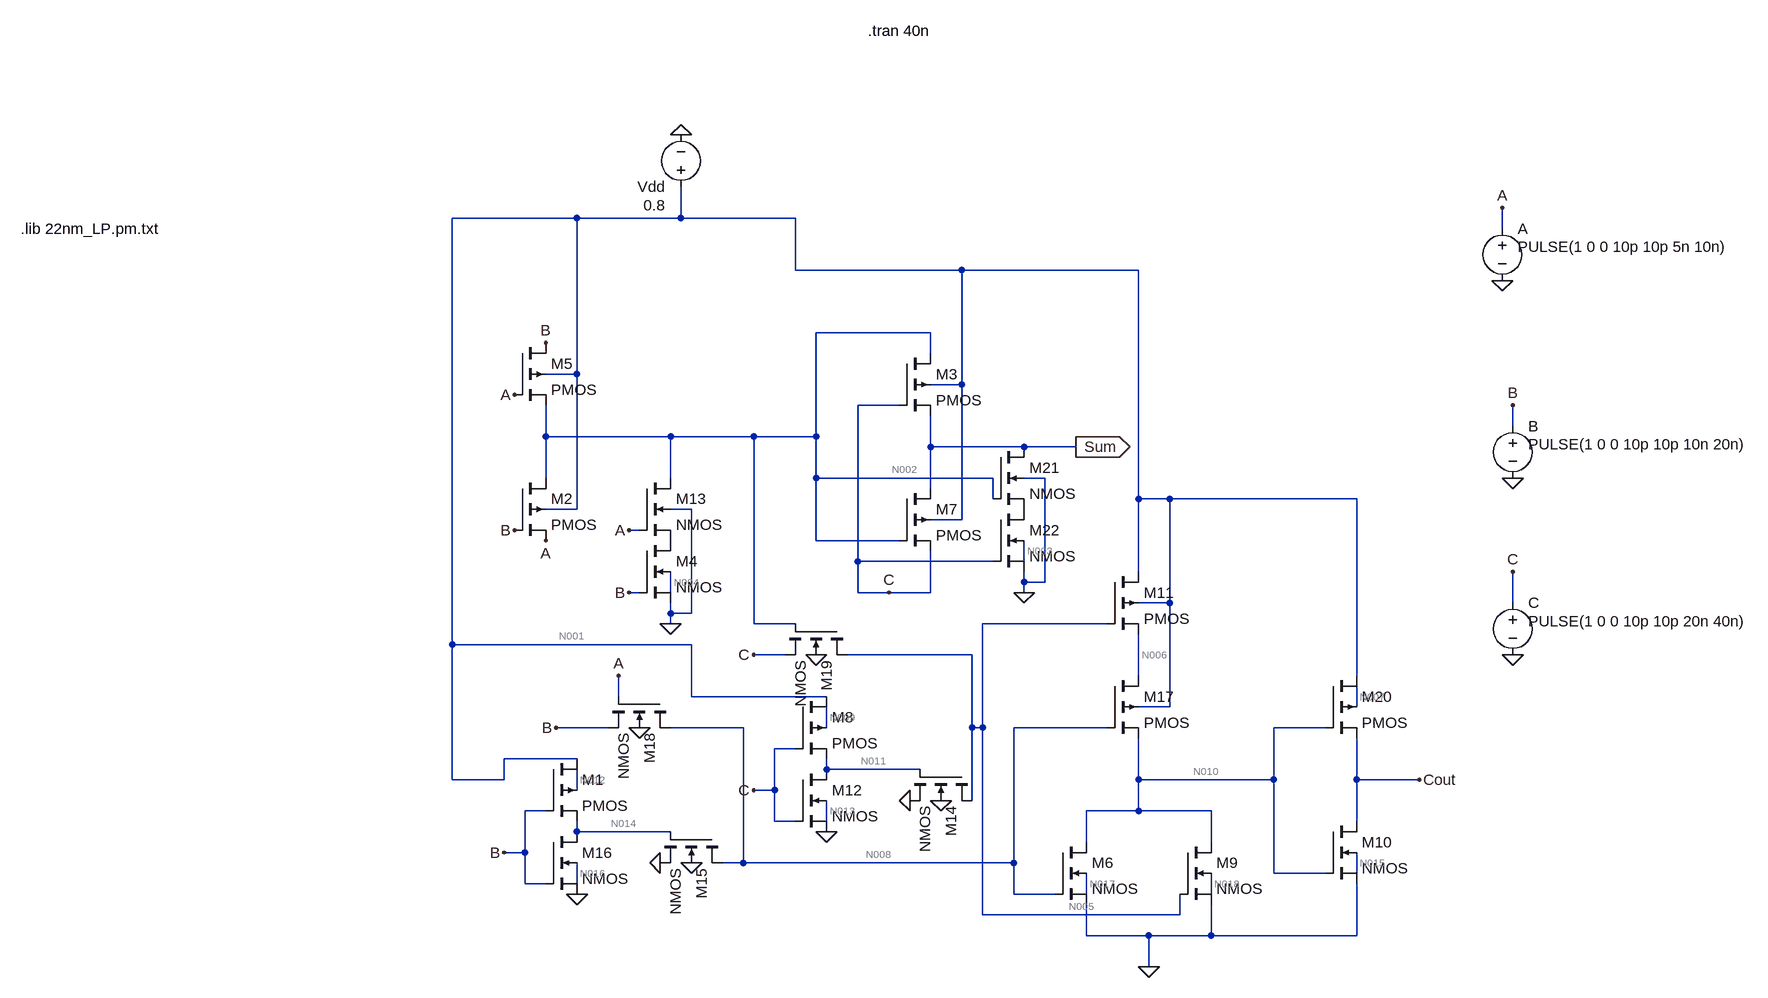
[diagram p0: schematic XA12T_45nm.asc]
XA12T_45nm.asc, the LTspice schematic file:
Version 4
SHEET 1 1060 3520
WIRE -800 -240 -992 -240
WIRE -640 -240 -640 -288
WIRE -640 -240 -800 -240
WIRE -464 -240 -640 -240
WIRE 624 -224 624 -256
WIRE -464 -160 -464 -240
WIRE -208 -160 -464 -160
WIRE 64 -160 -208 -160
WIRE -256 -64 -432 -64
WIRE -256 -32 -256 -64
WIRE -800 0 -800 -240
WIRE -800 0 -848 0
WIRE -208 16 -208 -160
WIRE -208 16 -256 16
WIRE -304 48 -368 48
WIRE 640 80 640 48
WIRE -848 96 -848 48
WIRE -656 96 -848 96
WIRE -528 96 -656 96
WIRE -432 96 -432 -64
WIRE -432 96 -528 96
WIRE -256 112 -256 64
WIRE -112 112 -256 112
WIRE -32 112 -112 112
WIRE -848 160 -848 96
WIRE -656 160 -656 96
WIRE -432 160 -432 96
WIRE -160 160 -432 160
WIRE -80 160 -112 160
WIRE -256 176 -256 112
WIRE -160 192 -160 160
WIRE 64 192 64 -160
WIRE 112 192 64 192
WIRE 400 192 112 192
WIRE -800 208 -800 0
WIRE -800 208 -848 208
WIRE -624 208 -656 208
WIRE -208 224 -208 16
WIRE -208 224 -256 224
WIRE -704 240 -720 240
WIRE -432 256 -432 160
WIRE -304 256 -432 256
WIRE -368 288 -368 48
WIRE -160 288 -368 288
WIRE -112 288 -112 256
WIRE 64 304 64 192
WIRE -112 320 -112 304
WIRE -80 320 -80 160
WIRE -80 320 -112 320
WIRE -704 336 -720 336
WIRE -656 336 -656 304
WIRE -368 336 -368 288
WIRE -320 336 -368 336
WIRE -256 336 -256 272
WIRE -256 336 -320 336
WIRE -112 336 -112 320
WIRE 112 352 112 192
WIRE 112 352 64 352
WIRE 640 352 640 304
WIRE -656 368 -656 352
WIRE -624 368 -624 208
WIRE -624 368 -656 368
WIRE -656 384 -656 368
WIRE -528 384 -528 96
WIRE -464 384 -528 384
WIRE 16 384 -176 384
WIRE -992 416 -992 -240
WIRE -624 416 -992 416
WIRE -480 432 -528 432
WIRE -192 432 -384 432
WIRE 64 464 64 400
WIRE 400 464 400 192
WIRE -736 496 -736 464
WIRE -624 496 -624 416
WIRE -416 496 -624 496
WIRE 112 512 112 352
WIRE 112 512 64 512
WIRE 400 512 400 480
WIRE -752 544 -832 544
WIRE -544 544 -656 544
WIRE -416 544 -416 512
WIRE -192 544 -192 432
WIRE -176 544 -176 384
WIRE -176 544 -192 544
WIRE 16 544 -128 544
WIRE 352 544 272 544
WIRE -464 576 -496 576
WIRE -800 592 -912 592
WIRE -416 608 -416 592
WIRE -272 608 -416 608
WIRE -992 624 -992 416
WIRE -912 624 -912 592
WIRE -912 624 -992 624
WIRE 64 624 64 560
WIRE 272 624 272 544
WIRE 272 624 64 624
WIRE 400 624 400 560
WIRE 496 624 400 624
WIRE -800 640 -800 608
WIRE -496 640 -496 576
WIRE -496 640 -528 640
WIRE -192 656 -192 544
WIRE -848 672 -880 672
WIRE 64 672 64 624
WIRE 64 672 -16 672
WIRE 176 672 64 672
WIRE -496 688 -496 640
WIRE -464 688 -496 688
WIRE -416 688 -416 656
WIRE 400 688 400 624
WIRE -800 704 -800 688
WIRE -656 704 -800 704
WIRE -16 720 -16 672
WIRE 176 720 176 672
WIRE -880 736 -880 672
WIRE -880 736 -912 736
WIRE -544 752 -544 544
WIRE -544 752 -576 752
WIRE -128 752 -128 544
WIRE -128 752 -544 752
WIRE 272 768 272 624
WIRE 352 768 272 768
WIRE 400 768 400 736
WIRE -880 784 -880 736
WIRE -848 784 -880 784
WIRE -800 784 -800 752
WIRE -128 800 -128 752
WIRE -64 800 -128 800
WIRE -16 800 -16 768
WIRE 176 800 176 768
WIRE -176 832 -176 544
WIRE 128 832 128 800
WIRE 128 832 -176 832
WIRE -16 864 -16 816
WIRE 80 864 -16 864
WIRE 176 864 176 816
WIRE 176 864 80 864
WIRE 400 864 400 784
WIRE 400 864 176 864
WIRE 80 912 80 864
FLAG 624 -144 0
FLAG 640 160 0
FLAG 640 432 0
FLAG 624 -256 A
FLAG 640 48 B
FLAG 640 304 C
FLAG -640 -368 0
FLAG -896 32 A
FLAG -848 256 A
FLAG -896 240 B
FLAG -848 -48 B
FLAG -704 544 0
FLAG -432 432 0
FLAG -832 544 B
FLAG -736 464 A
FLAG -528 432 C
FLAG 80 912 0
FLAG 496 624 Cout
FLAG -656 384 0
FLAG -720 240 A
FLAG -720 336 B
FLAG -112 336 0
FLAG -320 336 C
FLAG -32 112 Sum
IOPIN -32 112 Out
FLAG -800 800 0
FLAG -672 752 0
FLAG -624 752 0
FLAG -912 736 B
FLAG -416 704 0
FLAG -288 656 0
FLAG -240 656 0
FLAG -528 640 C
SYMBOL voltage 624 -240 R0
WINDOW 3 24 44 Left 2
WINDOW 123 0 0 Left 0
WINDOW 39 0 0 Left 0
SYMATTR Value PULSE(1 0 0 10p 10p 5n 10n)
SYMATTR InstName A
SYMBOL voltage 640 64 R0
WINDOW 3 24 44 Left 2
WINDOW 123 0 0 Left 0
WINDOW 39 0 0 Left 0
SYMATTR Value PULSE(1 0 0 10p 10p 10n 20n)
SYMATTR InstName B
SYMBOL voltage 640 336 R0
WINDOW 3 24 44 Left 2
WINDOW 123 0 0 Left 0
WINDOW 39 0 0 Left 0
SYMATTR Value PULSE(1 0 0 10p 10p 20n 40n)
SYMATTR InstName C
SYMBOL voltage -640 -272 R180
WINDOW 3 24 -12 Left 2
WINDOW 123 0 0 Left 0
WINDOW 39 0 0 Left 0
SYMATTR Value 0.8
SYMATTR InstName Vdd
SYMBOL pmos4 -896 -48 R0
SYMATTR InstName M5
SYMATTR Value2 l=22n w=88n
SYMBOL nmos4 -704 160 R0
SYMATTR InstName M13
SYMATTR Value2 l=22n w=44n
SYMBOL pmos4 -848 592 R0
SYMATTR InstName M1
SYMATTR Value2 l=22n w=88n
SYMBOL pmos4 -896 160 R0
SYMATTR InstName M2
SYMATTR Value2 l=22n w=88n
SYMBOL pmos4 -304 -32 R0
SYMATTR InstName M3
SYMATTR Value2 l=22n w=88n
SYMBOL pmos4 -304 176 R0
SYMATTR InstName M7
SYMATTR Value2 l=22n w=88n
SYMBOL pmos4 -464 496 R0
SYMATTR InstName M8
SYMATTR Value2 l=22n w=88n
SYMBOL pmos4 16 304 R0
SYMATTR InstName M11
SYMATTR Value2 l=22n w=88n
SYMBOL pmos4 16 464 R0
SYMATTR InstName M17
SYMATTR Value2 l=22n w=88n
SYMBOL pmos4 352 464 R0
SYMATTR InstName M20
SYMATTR Value2 l=22n w=88n
SYMBOL nmos4 -704 256 R0
SYMATTR InstName M4
SYMATTR Value2 l=22n w=44n
SYMBOL nmos4 -64 720 R0
SYMATTR InstName M6
SYMATTR Value2 l=22n w=44n
SYMBOL nmos4 128 720 R0
SYMATTR InstName M9
SYMATTR Value2 l=22n w=44n
SYMBOL nmos4 352 688 R0
SYMATTR InstName M10
SYMATTR Value2 l=22n w=44n
SYMBOL nmos4 -464 608 R0
SYMATTR InstName M12
SYMATTR Value2 l=22n w=44n
SYMBOL nmos4 -192 608 R90
SYMATTR InstName M14
SYMATTR Value2 l=22n w=44n
SYMBOL nmos4 -576 704 R90
SYMATTR InstName M15
SYMATTR Value2 l=22n w=44n
SYMBOL nmos4 -848 704 R0
SYMATTR InstName M16
SYMATTR Value2 l=22n w=44n
SYMBOL nmos4 -656 496 R90
SYMATTR InstName M18
SYMATTR Value2 l=22n w=44n
SYMBOL nmos4 -384 384 R90
SYMATTR InstName M19
SYMATTR Value2 l=22n w=44n
SYMBOL nmos4 -160 112 R0
SYMATTR InstName M21
SYMATTR Value2 l=22n w=44n
SYMBOL nmos4 -160 208 R0
SYMATTR InstName M22
SYMATTR Value2 l=22n w=44n
TEXT -352 -528 Left 2 !.tran 40n
TEXT -1656 -224 Left 2 !.lib 22nm_LP.pm.txt

The netlist it stands for:
* XA12T_45nm.asc
V§A A 0 PULSE(1 0 0 10p 10p 5n 10n)
V§B B 0 PULSE(1 0 0 10p 10p 10n 20n)
V§C C 0 PULSE(1 0 0 10p 10p 20n 40n)
Vdd N001 0 0.8
M5 B A N002 N001 PMOS l=22n w=88n
M13 N002 A P001 0 NMOS l=22n w=44n
M1 N001 B N014 N012 PMOS l=22n w=88n
M2 N002 B A N001 PMOS l=22n w=88n
M3 N002 C Sum N001 PMOS l=22n w=88n
M7 Sum N002 C N001 PMOS l=22n w=88n
M8 N001 C N011 N009 PMOS l=22n w=88n
M11 N001 N005 N006 N001 PMOS l=22n w=88n
M17 N006 N008 N010 N001 PMOS l=22n w=88n
M20 N001 N010 Cout N007 PMOS l=22n w=88n
M4 P001 B 0 N004 NMOS l=22n w=44n
M6 N010 N008 0 N017 NMOS l=22n w=44n
M9 N010 N005 0 N018 NMOS l=22n w=44n
M10 Cout N010 0 N015 NMOS l=22n w=44n
M12 N011 C 0 N013 NMOS l=22n w=44n
M14 N005 N011 0 0 NMOS l=22n w=44n
M15 N008 N014 0 0 NMOS l=22n w=44n
M16 N014 B 0 N016 NMOS l=22n w=44n
M18 N008 A B 0 NMOS l=22n w=44n
M19 N005 N002 C 0 NMOS l=22n w=44n
M21 Sum N002 P002 0 NMOS l=22n w=44n
M22 P002 C 0 N003 NMOS l=22n w=44n
.model NMOS NMOS
.model PMOS PMOS
.lib standard.mos
.tran 40n
.lib 22nm_LP.pm.txt
.backanno
.end

* Results of the author's LTspice run, read from the files saved beside the schematic
* Operating Point, zero values left out:
*   V(a) = 1 V
*   V(b) = 1 V
*   V(c) = 1 V
*   V(n001) = 800 mV
*   V(n002) = 6.09 mV
*   V(p001) = 2.992 mV
*   V(n014) = 715.5 nV
*   V(n012) = 675.4 mV
*   V(sum) = 999 mV
*   V(n011) = 683.3 nV
*   V(n009) = 675.4 mV
*   V(n005) = 146.9 mV
*   V(n006) = 799.6 mV
*   V(n008) = 735.2 mV
*   V(n010) = 303.4 µV
*   V(cout) = 799.9 mV
*   V(n007) = 677.7 mV
*   V(n004) = 178.8 mV
*   V(n017) = 25.82 mV
*   V(n018) = 155 µV
*   V(n015) = 247.2 mV
*   V(n013) = 175.7 mV
*   V(n016) = 175.7 mV
*   V(p002) = 88.44 µV
*   V(n003) = 175.8 mV
*   Id(M22) = 18.55 nA
*   Ig(M22) = 48.6 pA
*   Is(M22) = -18.6 nA
*   Id(M21) = 18.57 nA
*   Ig(M21) = -20.15 pA
*   Ib(M21) = -1.012 pA
*   Is(M21) = -18.55 nA
*   Id(M19) = -61.48 pA
*   Ig(M19) = -20.36 pA
*   Ib(M19) = -1.157 pA
*   Is(M19) = 83 pA
*   Id(M18) = -2.717 nA
*   Ib(M18) = -1.753 pA
*   Is(M18) = 2.719 nA
*   Id(M16) = 121.7 pA
*   Ig(M16) = 48.6 pA
*   Is(M16) = -170.1 pA
*   Id(M15) = 2.707 nA
*   Ig(M15) = -6.918 pA
*   Is(M15) = -2.7 nA
*   Id(M14) = 61.53 pA
*   Is(M14) = -61.22 pA
*   Id(M12) = 114.9 pA
*   Ig(M12) = 48.6 pA
*   Is(M12) = -163.3 pA
*   Id(M10) = 19.81 nA
*   Ig(M10) = -9.172 pA
*   Is(M10) = -19.8 nA
*   Id(M9) = 11.96 pA
*   Is(M9) = -11.97 pA
*   Id(M6) = 50.71 nA
*   Ig(M6) = 9.493 pA
*   Is(M6) = -50.72 nA
*   Id(M4) = 627.7 nA
*   Ig(M4) = 48.57 pA
*   Is(M4) = -627.8 nA
*   Id(M13) = 627.7 nA
*   Ig(M13) = 49.96 pA
*   Ib(M13) = -11.36 pA
*   Is(M13) = -627.7 nA
*   Id(M20) = 19.81 nA
*   Is(M20) = -19.81 nA
*   Id(M17) = 50.71 nA
*   Is(M17) = -50.71 nA
*   Id(M11) = 50.71 nA
*   Is(M11) = -50.71 nA
*   Id(M8) = 115.4 pA
*   Is(M8) = -114.7 pA
*   Id(M7) = -222.7 nA
*   Ig(M7) = -21.22 pA
*   Ib(M7) = -1.186 pA
*   Is(M7) = 222.7 nA
*   Id(M3) = -204.1 nA
*   Is(M3) = 204.1 nA
*   Id(M2) = -211.8 nA
*   Is(M2) = 211.8 nA
*   Id(M1) = 115.4 pA
*   Is(M1) = -114.7 pA
*   Id(M5) = 211.8 nA
*   Ib(M5) = -22.2 pA
*   Is(M5) = -211.8 nA
*   I(Vdd) = -70.73 nA
*   I(C) = -222.9 nA
*   I(B) = -214.6 nA
*   I(A) = -211.8 nA
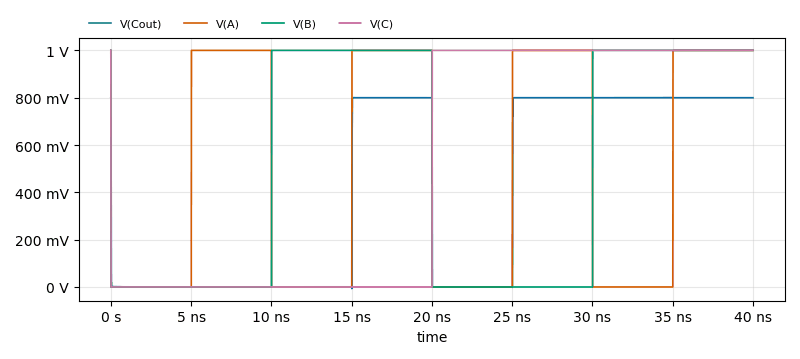
[diagram p1: Transient Analysis of XA12T_45nm.asc, plotted from the saved traces]
* Transient Analysis, 1 run:
*   V(Cout): min -7.8 mV, max 812.9 mV, average 399.6 mV, rms 565 mV, last 799.9 mV
*   V(A): min 0 V, max 1 V, average 499 mV, rms 706.2 mV, last 1 V
*   V(B): min 0 V, max 1 V, average 499.5 mV, rms 706.6 mV, last 1 V
*   V(C): min 0 V, max 1 V, average 499.7 mV, rms 706.9 mV, last 1 V